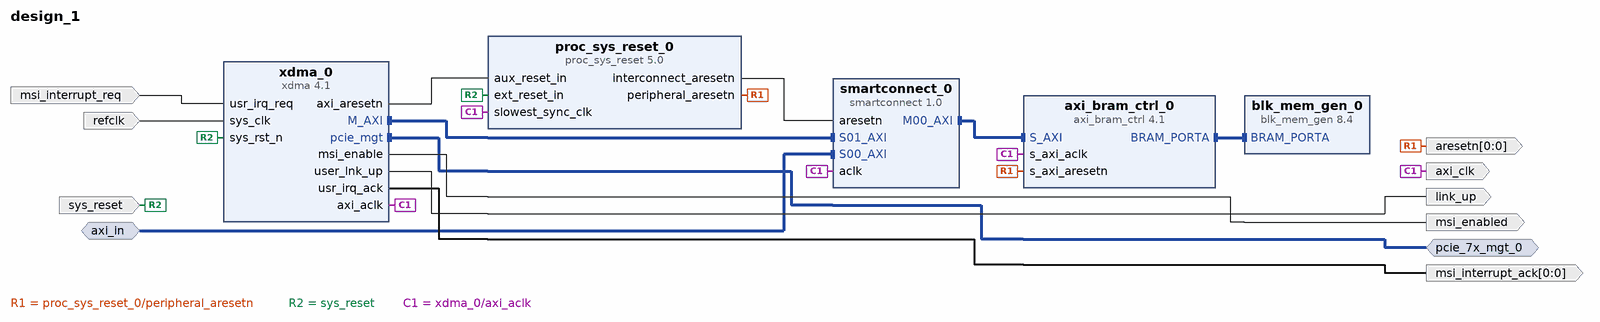
[diagram p0: block diagram of the top level]
# Vivado block design design_1, xc7a35tfgg484-2, Vivado 2024.2
create_bd_design design_1

create_bd_intf_port -mode Master -vlnv xilinx.com:interface:pcie_7x_mgt_rtl:1.0 pcie_7x_mgt_0
create_bd_intf_port -mode Slave -vlnv xilinx.com:interface:aximm_rtl:1.0 axi_in
set_property -dict [list \
  CONFIG.ADDR_WIDTH 16 \
  CONFIG.ARUSER_WIDTH 0 \
  CONFIG.AWUSER_WIDTH 0 \
  CONFIG.BUSER_WIDTH 0 \
  CONFIG.DATA_WIDTH 256 \
  CONFIG.FREQ_HZ 125000000 \
  CONFIG.HAS_BRESP 1 \
  CONFIG.HAS_BURST 1 \
  CONFIG.HAS_CACHE 0 \
  CONFIG.HAS_LOCK 0 \
  CONFIG.HAS_PROT 1 \
  CONFIG.HAS_QOS 0 \
  CONFIG.HAS_REGION 0 \
  CONFIG.HAS_RRESP 1 \
  CONFIG.HAS_WSTRB 1 \
  CONFIG.ID_WIDTH 0 \
  CONFIG.MAX_BURST_LENGTH 1 \
  CONFIG.NUM_READ_OUTSTANDING 1 \
  CONFIG.NUM_READ_THREADS 1 \
  CONFIG.NUM_WRITE_OUTSTANDING 1 \
  CONFIG.NUM_WRITE_THREADS 1 \
  CONFIG.PROTOCOL AXI4 \
  CONFIG.READ_WRITE_MODE READ_WRITE \
  CONFIG.RUSER_BITS_PER_BYTE 0 \
  CONFIG.RUSER_WIDTH 0 \
  CONFIG.WUSER_BITS_PER_BYTE 0 \
  CONFIG.WUSER_WIDTH 0 \
] [get_bd_intf_ports axi_in]
create_bd_port -dir I -type clk refclk
set_property -dict {CONFIG.FREQ_HZ 100000000} [get_bd_ports refclk]
create_bd_port -dir I -type rst sys_reset
set_property -dict {CONFIG.POLARITY ACTIVE_LOW} [get_bd_ports sys_reset]
create_bd_port -dir O link_up
create_bd_port -dir O -type clk axi_clk
set_property -dict {CONFIG.ASSOCIATED_BUSIF axi_in CONFIG.FREQ_HZ 125000000} [get_bd_ports axi_clk]
create_bd_port -dir O -from 0 -to 0 -type rst aresetn
create_bd_port -dir I -type intr msi_interrupt_req
create_bd_port -dir O -from 0 -to 0 msi_interrupt_ack
create_bd_port -dir O msi_enabled

create_bd_cell -type ip -vlnv xilinx.com:ip:smartconnect:1.0 smartconnect_0
set_property -dict {CONFIG.HAS_ARESETN 1 CONFIG.NUM_MI 1 CONFIG.NUM_SI 2} [get_bd_cells smartconnect_0]
create_bd_cell -type ip -vlnv xilinx.com:ip:blk_mem_gen:8.4 blk_mem_gen_0
create_bd_cell -type ip -vlnv xilinx.com:ip:axi_bram_ctrl:4.1 axi_bram_ctrl_0
set_property -dict [list \
  CONFIG.DATA_WIDTH 256 \
  CONFIG.PROTOCOL AXI4 \
  CONFIG.RD_CMD_OPTIMIZATION 1 \
  CONFIG.SINGLE_PORT_BRAM 1 \
] [get_bd_cells axi_bram_ctrl_0]
create_bd_cell -type ip -vlnv xilinx.com:ip:xdma:4.1 xdma_0
set_property -dict [list \
  CONFIG.PF0_DEVICE_ID_mqdma 9021 \
  CONFIG.PF2_DEVICE_ID_mqdma 9221 \
  CONFIG.PF3_DEVICE_ID_mqdma 9321 \
  CONFIG.axilite_master_en false \
  CONFIG.axist_bypass_en false \
  CONFIG.axisten_freq 125 \
  CONFIG.cfg_mgmt_if false \
  CONFIG.pcie_extended_tag true \
  CONFIG.pf0_device_id 7021 \
  CONFIG.pf0_interrupt_pin NONE \
  CONFIG.pf0_msi_cap_multimsgcap 2_vectors \
  CONFIG.pf0_msi_enabled true \
  CONFIG.pf0_msix_enabled false \
  CONFIG.pl_link_cap_max_link_speed 5.0_GT/s \
  CONFIG.plltype QPLL1 \
  CONFIG.xdma_axilite_slave false \
  CONFIG.xdma_rnum_chnl 1 \
  CONFIG.xdma_sts_ports false \
] [get_bd_cells xdma_0]
create_bd_cell -type ip -vlnv xilinx.com:ip:proc_sys_reset:5.0 proc_sys_reset_0

# ---- connections ----

connect_bd_intf_net [get_bd_intf_pins axi_bram_ctrl_0/BRAM_PORTA] [get_bd_intf_pins blk_mem_gen_0/BRAM_PORTA]
connect_bd_intf_net [get_bd_intf_ports axi_in] [get_bd_intf_pins smartconnect_0/S00_AXI]
connect_bd_intf_net [get_bd_intf_pins smartconnect_0/M00_AXI] [get_bd_intf_pins axi_bram_ctrl_0/S_AXI]
connect_bd_intf_net [get_bd_intf_pins xdma_0/M_AXI] [get_bd_intf_pins smartconnect_0/S01_AXI]
connect_bd_intf_net [get_bd_intf_ports pcie_7x_mgt_0] [get_bd_intf_pins xdma_0/pcie_mgt]
connect_bd_net -net msi_interrupt_1 [get_bd_ports msi_interrupt_req] [get_bd_pins xdma_0/usr_irq_req]
connect_bd_net [get_bd_pins proc_sys_reset_0/interconnect_aresetn] [get_bd_pins smartconnect_0/aresetn]
connect_bd_net [get_bd_pins proc_sys_reset_0/peripheral_aresetn] [get_bd_ports aresetn] [get_bd_pins axi_bram_ctrl_0/s_axi_aresetn]
connect_bd_net [get_bd_ports refclk] [get_bd_pins xdma_0/sys_clk]
connect_bd_net [get_bd_ports sys_reset] [get_bd_pins proc_sys_reset_0/ext_reset_in] [get_bd_pins xdma_0/sys_rst_n]
connect_bd_net [get_bd_pins xdma_0/axi_aclk] \
  [get_bd_pins proc_sys_reset_0/slowest_sync_clk] [get_bd_ports axi_clk] [get_bd_pins axi_bram_ctrl_0/s_axi_aclk] \
  [get_bd_pins smartconnect_0/aclk]
connect_bd_net [get_bd_pins xdma_0/axi_aresetn] [get_bd_pins proc_sys_reset_0/aux_reset_in]
connect_bd_net [get_bd_pins xdma_0/msi_enable] [get_bd_ports msi_enabled]
connect_bd_net [get_bd_pins xdma_0/user_lnk_up] [get_bd_ports link_up]
connect_bd_net [get_bd_pins xdma_0/usr_irq_ack] [get_bd_ports msi_interrupt_ack]

# ---- address map ----
assign_bd_address -offset 0x0000 -range 64K -target_address_space [get_bd_addr_spaces axi_in] [get_bd_addr_segs axi_bram_ctrl_0/S_AXI/Mem0]
assign_bd_address -offset 0x0000000000000000 -range 64K -target_address_space [get_bd_addr_spaces xdma_0/M_AXI] [get_bd_addr_segs axi_bram_ctrl_0/S_AXI/Mem0]

validate_bd_design
save_bd_design
